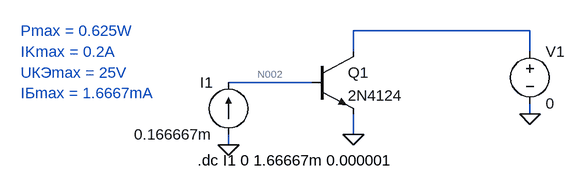
[diagram p0: schematic 1.asc]
1.asc, the LTspice schematic file:
Version 4
SHEET 1 1056 680
WIRE 272 128 0 128
WIRE 0 160 0 128
WIRE 272 160 272 128
WIRE -64 208 -192 208
WIRE 272 256 272 240
WIRE 0 288 0 256
WIRE -192 304 -192 288
FLAG 272 256 0
FLAG -192 304 0
FLAG 0 288 0
SYMBOL voltage 272 144 R0
SYMATTR InstName V1
SYMATTR Value 0
SYMBOL npn -64 160 R0
SYMATTR InstName Q1
SYMATTR Value 2N4124
SYMBOL current -192 288 R180
WINDOW 0 24 80 Left 2
WINDOW 3 24 0 Left 2
SYMATTR InstName I1
SYMATTR Value 0.166667m
TEXT -240 328 Left 2 !.dc I1 0 1.66667m 0.000001
TEXT -512 128 Left 2 ;Pmax = 0.625W
TEXT -512 160 Left 2 ;IKmax = 0.2A
TEXT -512 192 Left 2 ;UКЭmax = 25V
TEXT -512 224 Left 2 ;IБmax = 1.6667mA

The netlist it stands for:
* 1.asc
V1 N001 0 0
Q1 N001 N002 0 0 2N4124
I1 0 N002 0.166667m
.model NPN NPN
.model PNP PNP
.lib standard.bjt
.dc I1 0 1.66667m 0.000001
* Pmax = 0.625W
* IKmax = 0.2A
* UКЭmax = 25V
* IБmax = 1.6667mA
.backanno
.end

* Results of the author's LTspice run, read from the files saved beside the schematic
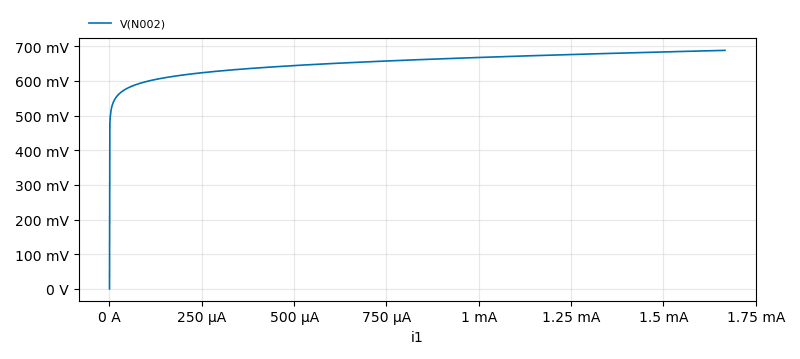
[diagram p1: DC transfer characteristic of 1.asc, plotted from the saved traces]
* DC transfer characteristic, 1 run:
*   V(N002): 0 V at i1=0 A, 688.3 mV at i1=1.667 mA, min 0 V, max 688.3 mV